# EAGLE design powerBoard (EAGLE 6.6.0)
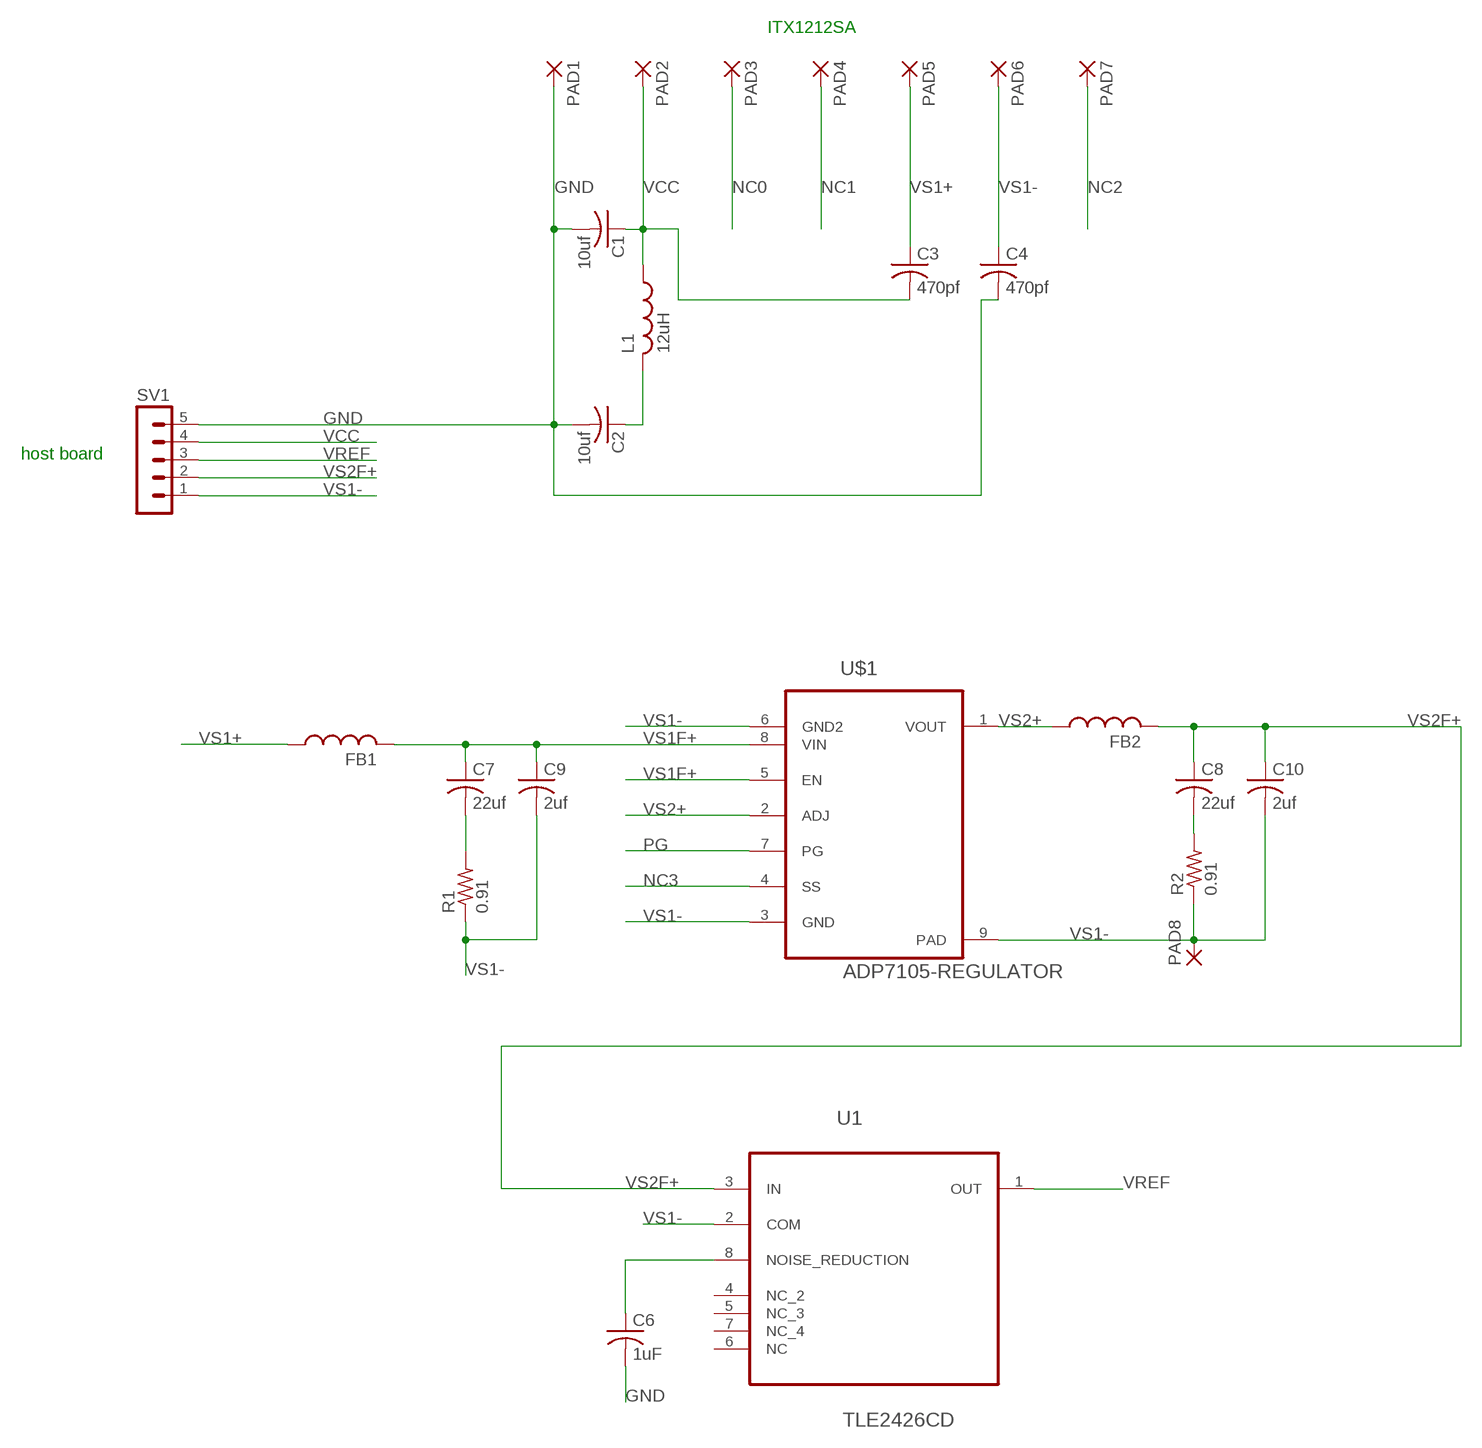
[diagram p0: schematic, sheet 1]

## Parts
C1  10uf  C-USC0805K  [C0805K]
C2  10uf  C-USC0805K  [C0805K]
C3  470pf  C-USC0805K  [C0805K]
C4  470pf  C-USC0805K  [C0805K]
C6  1uF  C-USC0805  [C0805]
C7  22uf  C-USC0805K  [C0805K]
C8  22uf  C-USC0805K  [C0805K]
C9  2uf  C-USC0805K  [C0805K]
C10  2uf  C-USC0805K  [C0805K]
FB1  L-USL2012C  [L2012C]
FB2  L-USL2012C  [L2012C]
L1  12uH  L-USL2012C  [L2012C]
PAD1  SMD2  [SMD1,27-2,54]
PAD2  SMD2  [SMD1,27-2,54]
PAD3  SMD2  [SMD1,27-2,54]
PAD4  SMD2  [SMD1,27-2,54]
PAD5  SMD2  [SMD1,27-2,54]
PAD6  SMD2  [SMD1,27-2,54]
PAD7  SMD2  [SMD1,27-2,54]
PAD8  2,54/1,1  [2,54/1,1]
R1  0.91  R-US_R2012W  [R2012W]
R2  0.91  R-US_R2012W  [R2012W]
SV1  MA05-1  [MA05-1]
U1  TLE2426CD  [SOIC127P600X175-8N]
U$1  ADP7105-REGULATOR  [ADP7105-REGULATOR]

## Nets
GND: C1.2 C2.2 C4.2 C6.2 PAD1.1(P) SV1.5
N$1: C2.1 L1.2
N$2: C6.1 U1.8(NOISE_REDUCTION)
N$3: C8.2 R2.2
N$4: C7.2 R1.2
NC0: PAD3.1(P)
NC1: PAD4.1(P)
NC2: PAD7.1(P)
NC3: U$1.4(SS)
PG: U$1.7(PG)
VCC: C1.1 C3.2 L1.1 PAD2.1(P) SV1.4
VREF: SV1.3 U1.1(OUT)
VS1+: C3.1 FB1.1 PAD5.1(P)
VS1-: C4.1 C9.2 C10.2 PAD6.1(P) PAD8.1(P) R1.1 R2.1 SV1.1 U1.2(COM) U$1.3(GND) U$1.6(GND2) U$1.9(PAD)
VS1F+: C7.1 C9.1 FB1.2 U$1.5(EN) U$1.8(VIN)
VS2+: FB2.1 U$1.1(VOUT) U$1.2(ADJ)
VS2F+: C8.1 C10.1 FB2.2 SV1.2 U1.3(IN)
Unconnected: U1.4(NC_2) U1.5(NC_3) U1.6(NC) U1.7(NC_4)

## Notes on the sheet
- ITX1212SA
- host board

## Library data of the parts
C1-C4 C6-C10 = rcl:C-US: CAPACITOR, American symbol
FB1 FB2 = rcl:L-US: INDUCTOR, American symbol
L1 = resistor:L-US: INDUCTOR, American symbol
PAD1-PAD7 = wirepad:SMD2: SMD PAD
PAD8 = wirepad:2,54/1,1: THROUGH-HOLE PAD
R1 R2 = resistor:R-US_: RESISTOR, American symbol
SV1 = con-lstb:MA05-1: PIN HEADER; OC_FARNELL: unknown; OC_NEWARK: unknown
U1 = Texas Instruments_By_element14_Batch_1:TLE2426CD: PRECISION VIRTUAL GROUND; MPN: TLE2426CD; OC_FARNELL: 8454809; OC_NEWARK: 50B7917; PACKAGE: SOIC-8; SUPPLIER: Texas Instruments
U$1 = tuckerLib:ADP7105-REGULATOR

## Board
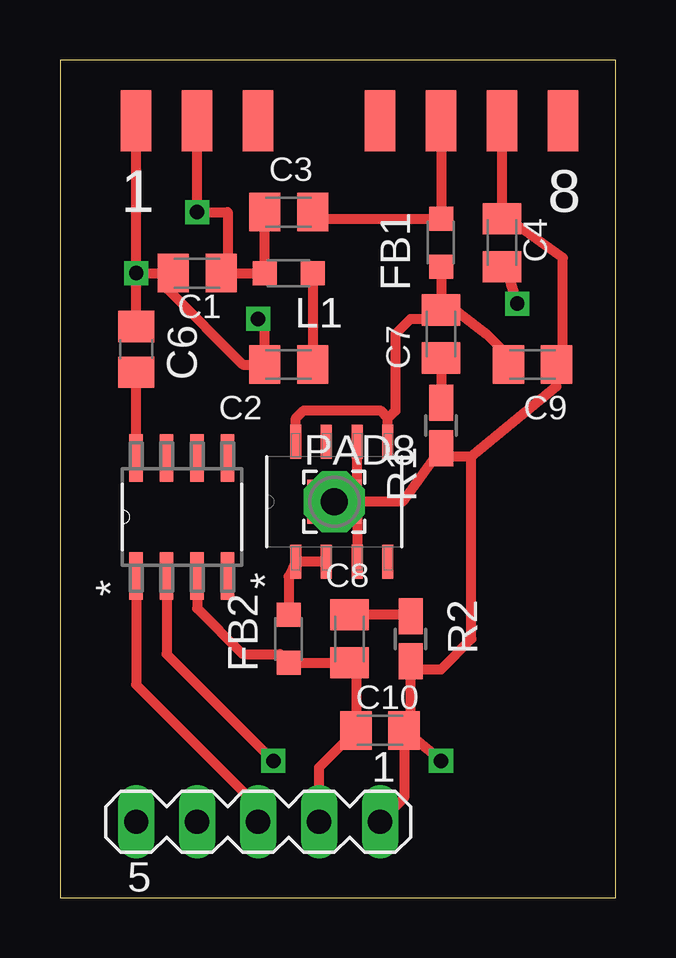
[diagram p1: board, top side]
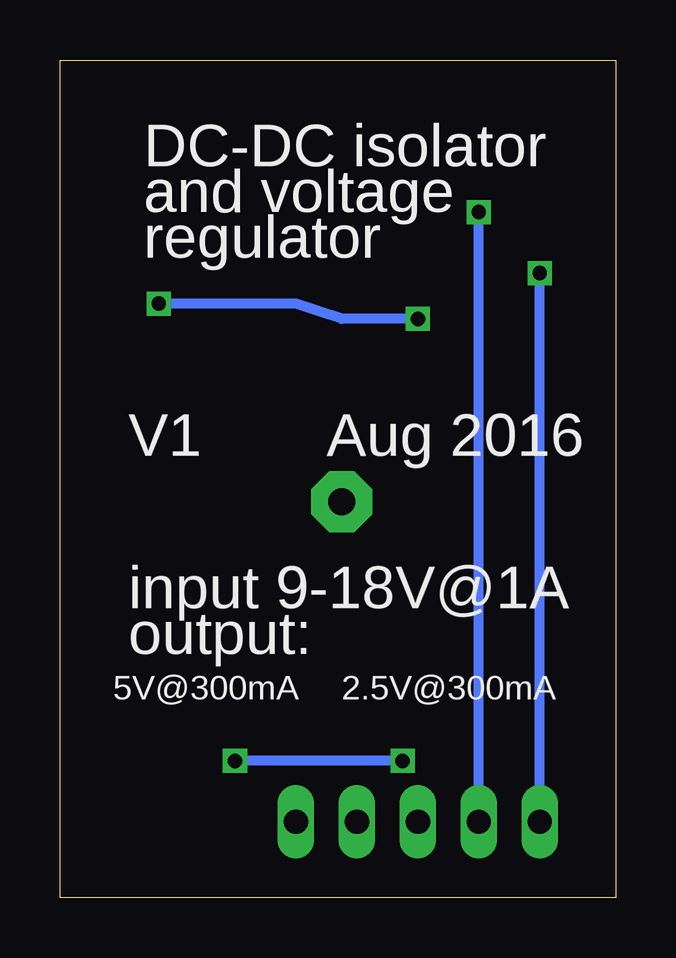
[diagram p2: board, bottom side, seen from below]

Size 23.16 x 34.91 mm. Coordinates in mm from the lower left corner, seen from the top.
Outline: 0,0 23.16,0 23.16,34.91 0,34.91 0,0
Copper layers (1*16): Top 0.035mm / dielectric 1.5mm / Bottom 0.035mm
Design rules "default *": minimum track width 10mil, minimum drill 10mil, track to track 8mil, track to pad 8mil, pad to pad 8mil, via to via 8mil, smd to smd 8mil, copper to edge 40mil, drill to drill 8mil, minimum pad ring 10mil, minimum via ring 8mil, stop-mask expansion 4mil, vias tented up to drill 0mil, thermal gap 10mil

### Footprints (pad centres in the part's own frame; a part is rotated, then mirrored left to right if it is on the bottom)
C0805K = smd 1.3 x 1.6: 1 -1,0; 2 1,0
C0805 = smd 1.3 x 1.5: 1 -0.95,0; 2 0.95,0
L2012C = smd 1 x 1: 1 -1,0; 2 1,0
SMD1,27-2,54 = smd 1.27 x 2.54: 1 0,0
2,54/1,1 = drill 1.118 pad 2.54 octagon: 1 0,0
R2012W = smd 1.5 x 1: 1 -0.94,0; 2 0.94,0
MA05-1 = drill 1.016 long: 1 -5.08,0; 2 -2.54,0; 3 0,0; 4 2.54,0; 5 5.08,0
SOIC127P600X175-8N = smd 1.981 x 0.559: 1 -2.464,1.905; 2 -2.464,0.635; 3 -2.464,-0.635; 4 -2.464,-1.905; 5 2.464,-1.905; 6 2.464,-0.635; 7 2.464,0.635; 8 2.464,1.905
ADP7105-REGULATOR = smd 1.422 x 0.457: 1 -2.502,1.6; 2 -2.502,0.33; 3 -2.502,-0.965; 4 -2.502,-2.235; 5 2.502,-2.235; 6 2.502,-0.965; 7 2.502,0.33; 8 2.502,1.6 | smd 1.829 x 2.261: 9 0,0

### Placement (x,y rotation side)
C1  5.71,26.04 180 top
C2  9.53,22.23 180 top
C3  9.53,28.57 180 top
C4  18.41,27.3 270 top
C6  3.17,22.86 90 top
C7  15.88,23.5 270 top
C8  12.06,10.79 90 top
C9  19.68,22.23 0 top
C10  13.34,6.99 0 top
FB1  15.88,27.3 270 top
FB2  9.53,10.79 270 top
L1  9.53,26.04 0 top
PAD1  3.17,32.38 0 top
PAD2  5.71,32.38 0 top
PAD3  8.26,32.38 0 top
PAD4  13.34,32.38 0 top
PAD5  15.88,32.38 0 top
PAD6  18.41,32.38 0 top
PAD7  20.95,32.38 0 top
PAD8  11.43,16.51 0 top
R1  15.88,19.68 90 top
R2  14.61,10.79 90 top
SV1  8.26,3.17 180 top
U1  5.08,15.88 90 top
U$1  11.43,16.51 90 top

### Tracks (layer width: path | path; a pad name or v marks a point on that pad's centre or on a via)
GND  (via drill 0.6)
  Top 0.406: v3.17,26.04 PAD1.1 | v8.26,24.13 8.53,23.86 C2.2 7.62,22.23 4.45,25.4 4.45,25.77 C1.2 v3.17,26.04 | v19.05,24.77 18.68,26.04 C4.2 | C6.2 v3.17,26.04
  Bottom 0.406: SV1.5 v3.17,26.04 | v8.26,24.13 11.43,24.13 13.34,24.77 v19.05,24.77
N$1
  Top 0.406: L1.2 10.79,26.04 10.53,25.77 C2.1
N$2
  Top 0.406: U1.8 C6.1
N$3
  Top 0.406: R2.2 14.54,11.79 C8.2
N$4
  Top 0.406: C7.2 R1.2
VCC  (via drill 0.6)
  Top 0.406: PAD2.1 v5.71,28.57 6.99,28.57 6.99,26.04 C1.1 L1.1 C3.2
  Bottom 0.406: SV1.4 v5.71,28.57
VREF
  Top 0.406: U1.1 3.17,8.89 8.26,3.81 SV1.3
VS1+
  Top 0.406: PAD5.1 FB1.1 10.79,28.3 C3.1
VS1-  (via drill 0.6)
  Top 0.406: C10.2 14.61,7.25 R2.1 14.94,9.53 15.88,9.53 17.14,10.79 17.14,18.41 | PAD6.1 C4.1 18.68,28.3 20.95,26.67 20.95,22.5 C9.2 20.68,21.32 17.14,18.41 | PAD8.1 12.39,16.18 U$1.3 | PAD8.1 12.39,16.84 U$1.6 | 17.14,18.41 16.2,18.41 R1.1 14.28,16.51 12.7,16.51 PAD8.1 | v15.88,5.71 C10.2 | C10.2 14.34,4.17 SV1.1 | U1.2 4.45,10.16 v8.89,5.71
  Bottom 0.406: v8.89,5.71 v15.88,5.71
VS1F+
  Top 0.406: FB1.2 C7.1 | C7.1 16.14,24.77 17.78,23.5 18.41,22.86 C9.1 | U$1.8 9.83,19.99 10.16,20.32 13.34,20.32 13.66,19.99 | C7.1 15.51,24.13 14.61,24.13 13.97,23.5 13.97,20.3 13.66,19.99 | U$1.5 13.66,19.99
VS2+
  Top 0.406: U$1.2 U$1.1 9.53,13.39 FB2.1
VS2F+
  Top 0.406: FB2.2 C8.1 12.34,9.53 C10.1 10.79,5.45 SV1.2 | FB2.2 9.26,9.53 | U1.3 5.71,12.06 7.62,10.16 9.16,10.16 FB2.2

### Text on the board
tNames: 1 | 8
bNames: DC-DC isolator | and voltage | regulator | Aug 2016 | V1 | input 9-18V@1A | output: | 2.5V@300mA | 5V@300mA